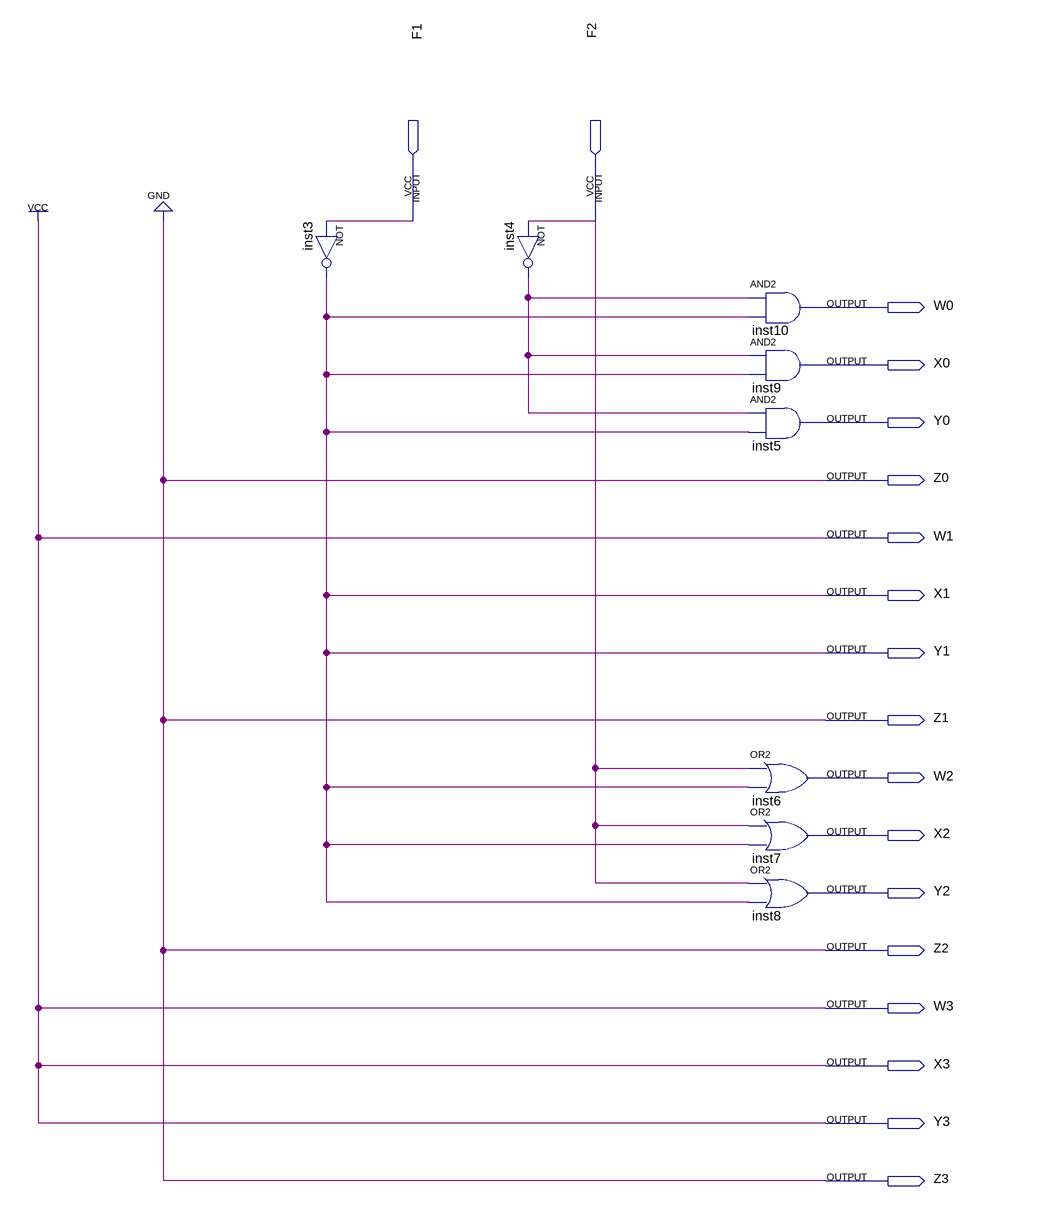
[diagram p0: schematic sheet]
// Quartus schematic pattern_recognizer.bdf as structural Verilog: 8 symbols, 18 pins
module pattern_recognizer (
  input  F1,
  input  F2,
  output W0,
  output X0,
  output Y0,
  output Z0,
  output W1,
  output X1,
  output Y1,
  output Z1,
  output W2,
  output X2,
  output Y2,
  output Z2,
  output W3,
  output X3,
  output Y3,
  output Z3
);

  wire inst4_out;

  not inst3 (X1, F1);
  not inst4 (inst4_out, F2);
  and inst10 (W0, inst4_out, X1);
  and inst9 (X0, inst4_out, X1);
  and inst5 (Y0, inst4_out, X1);
  or inst6 (W2, F2, X1);
  or inst7 (X2, F2, X1);
  or inst8 (Y2, F2, X1);

  assign W1 = 1'b1;
  assign W3 = 1'b1;
  assign X3 = 1'b1;
  assign Y1 = X1;
  assign Y3 = 1'b1;
  assign Z0 = 1'b0;
  assign Z1 = 1'b0;
  assign Z2 = 1'b0;
  assign Z3 = 1'b0;
endmodule
